# Altium schematic sheet misc.schdoc: MISC
size A4; Date: 10.06.2025; CheckedBy: BCY; DrawnBy: miaow; Revision: v1.0.0; SheetNumber: 18; SheetTotal: 18; BoardType: MAIN_PCB; Desc: Mechanical items
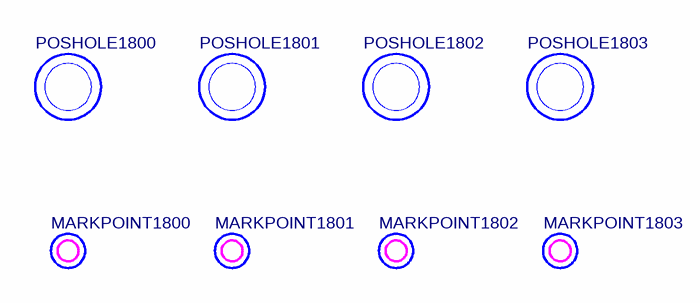
[diagram p0: misc.schdoc]

## Parts
MARKPOINT1800  MARKPOINT  [MARKPOINT-1.0]  (value not drawn)
MARKPOINT1801  MARKPOINT  [MARKPOINT-1.0]  (value not drawn)
MARKPOINT1802  MARKPOINT  [MARKPOINT-1.0]  (value not drawn)
MARKPOINT1803  MARKPOINT  [MARKPOINT-1.0]  (value not drawn)
POSHOLE1800  POSHOLE  [POSHOLE-2.6]  (value not drawn)
POSHOLE1801  POSHOLE  [POSHOLE-2.6]  (value not drawn)
POSHOLE1802  POSHOLE  [POSHOLE-2.6]  (value not drawn)
POSHOLE1803  POSHOLE  [POSHOLE-2.6]  (value not drawn)

## Notes on the sheet
- DRAWN
- CHECKED
- DRAWNBY
- SHEETS
- SHEETS_NO